# Altium schematic sheet 19 SMB1358.SchDoc
size 868 x 576 mm
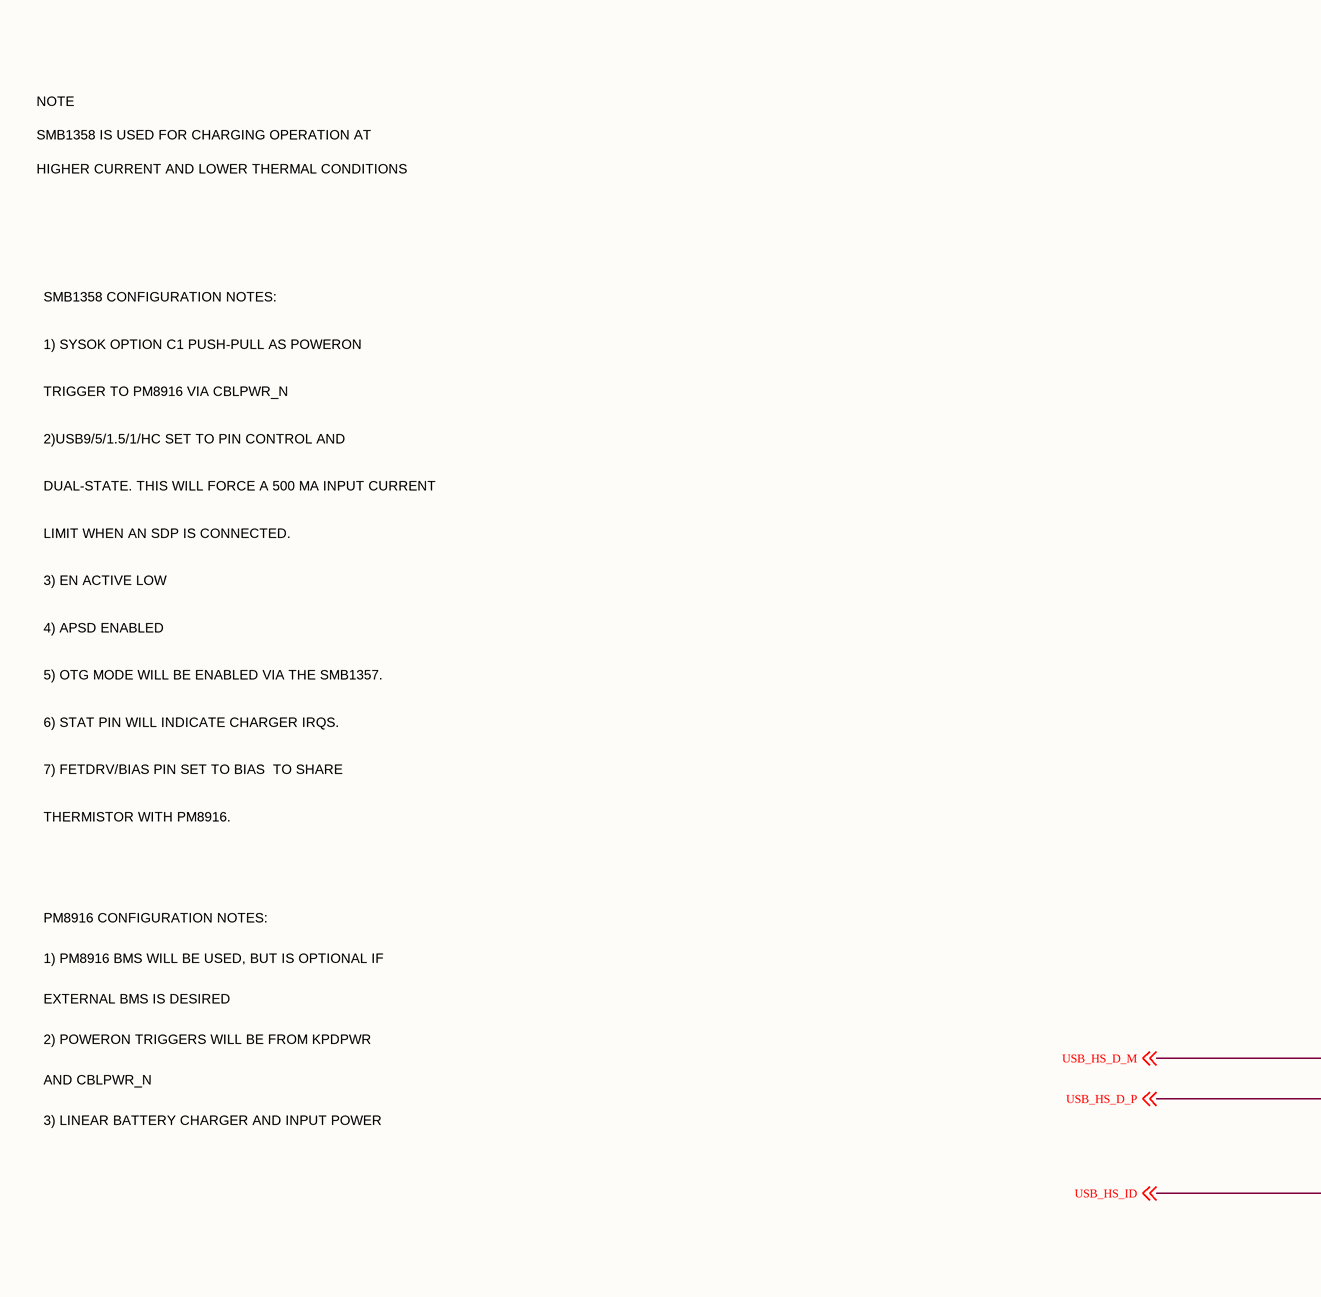
[diagram p0: 19 SMB1358.SchDoc, top left]
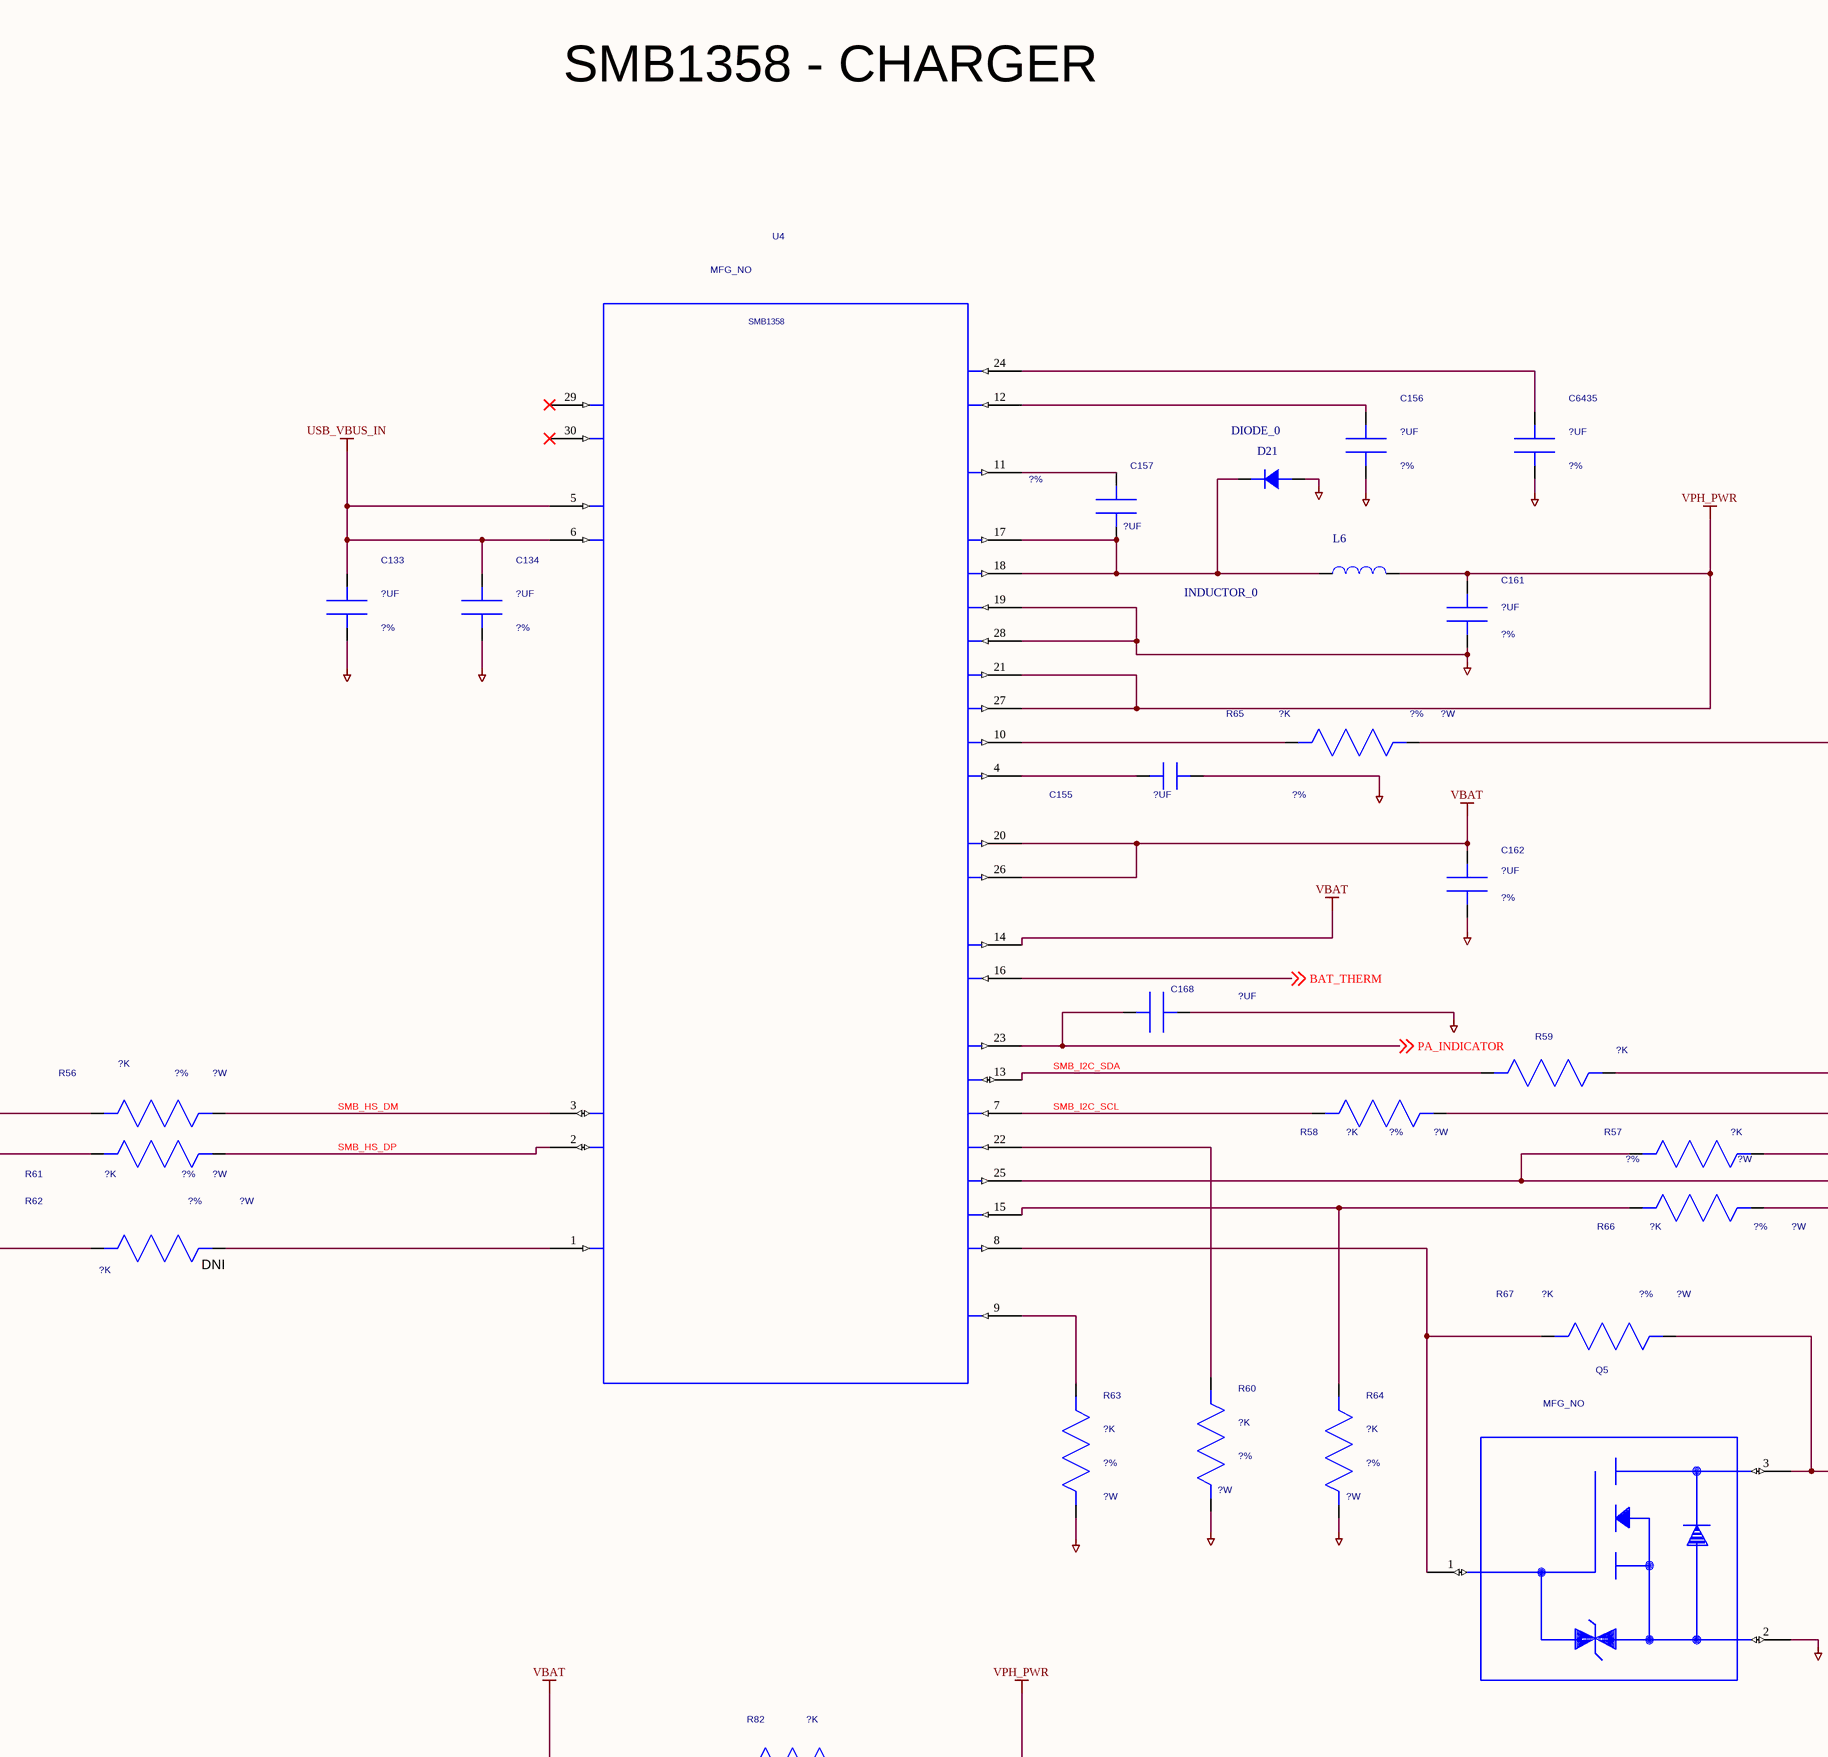
[diagram p1: 19 SMB1358.SchDoc, top middle]
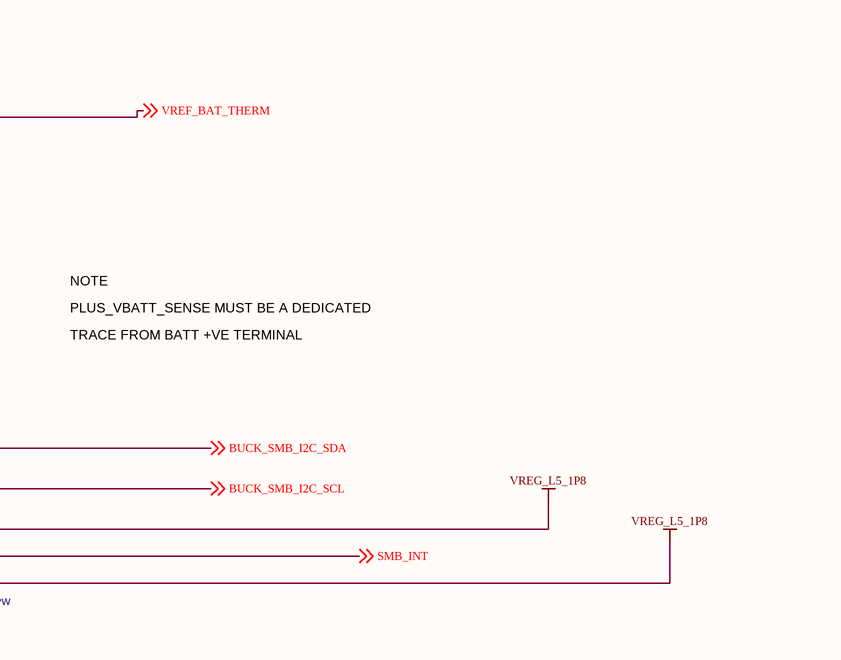
[diagram p2: 19 SMB1358.SchDoc, top right]
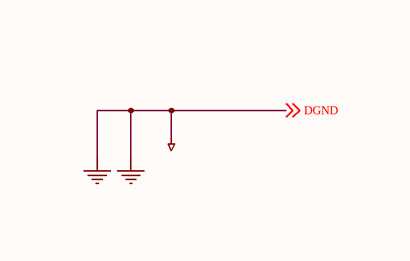
[diagram p3: 19 SMB1358.SchDoc, bottom left]
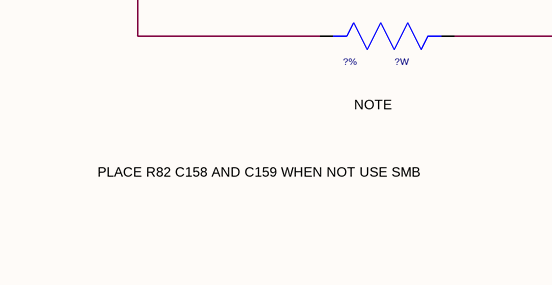
[diagram p4: 19 SMB1358.SchDoc, bottom middle]
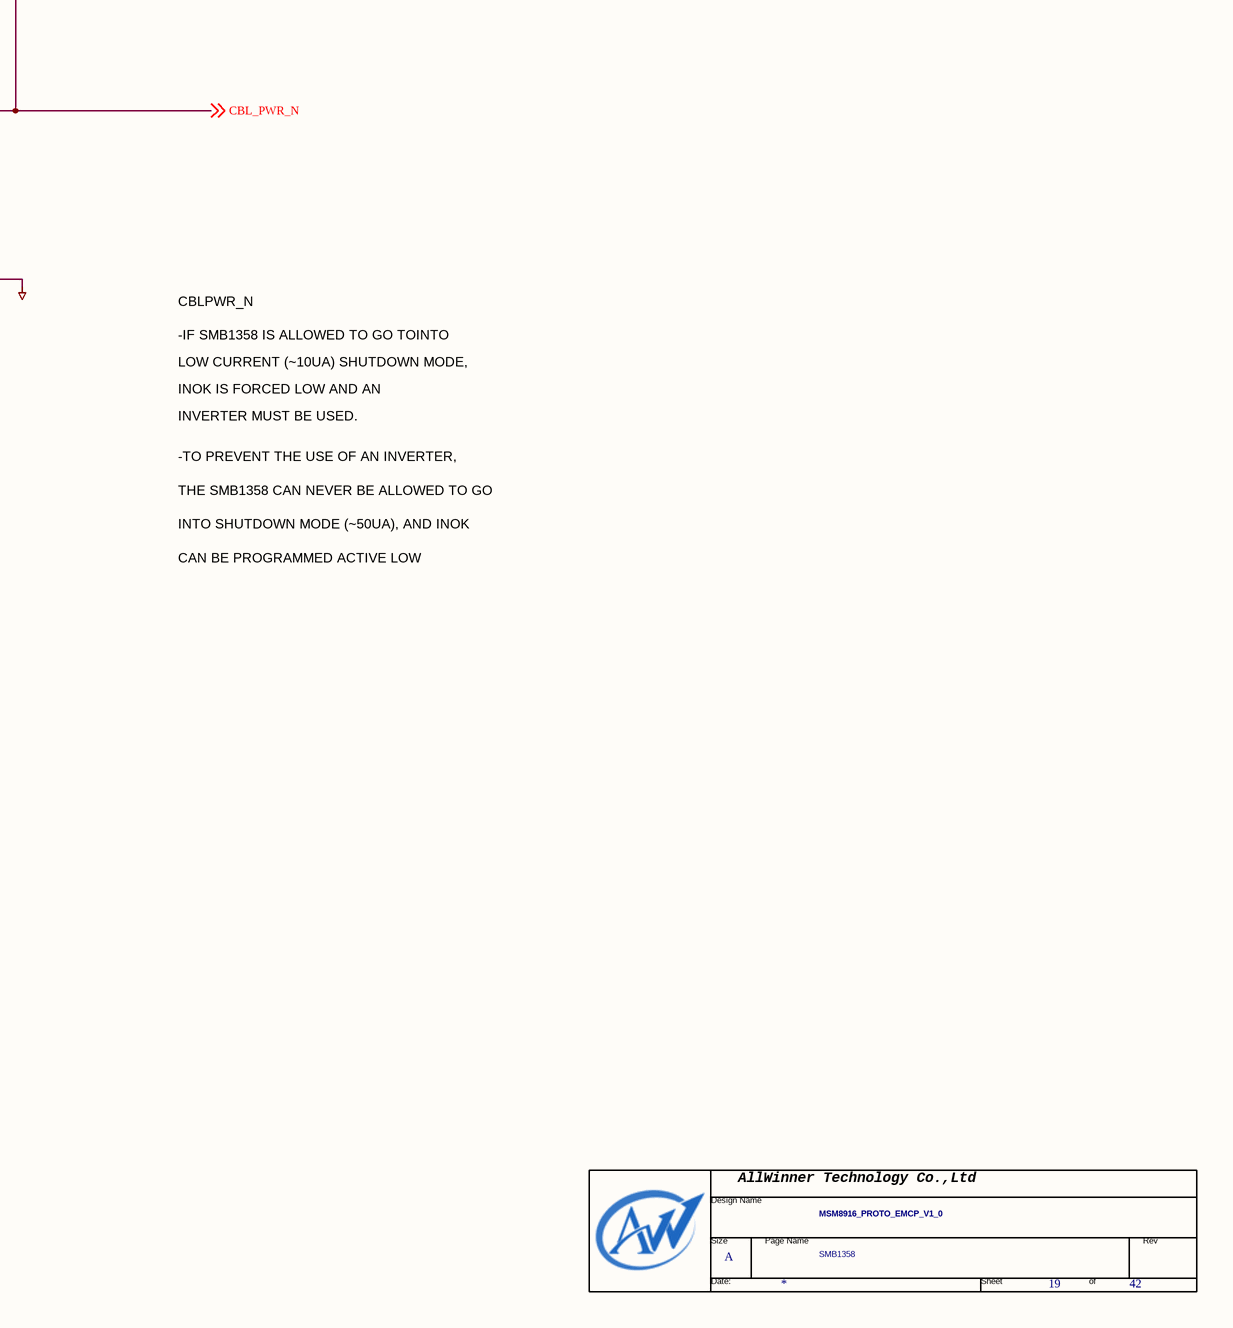
[diagram p5: 19 SMB1358.SchDoc, bottom right]

## Parts
*  Page Count: 42  Page Number: 19  Page Size: A  Title: MSM8916_PROTO_EMCP_V1_0  Doc: SMB1358  (hidden comment: TitleBlock0-AW)  (graphical)
C133  ?UF  Tolerance: ?%
C134  ?UF  Tolerance: ?%
C155  ?UF  Tolerance: ?%
C156  ?UF  Tolerance: ?%
C157  ?UF  Tolerance: ?%
C161  ?UF  Tolerance: ?%
C162  ?UF  Tolerance: ?%
C168  ?UF
C6435  ?UF  Tolerance: ?%
D21  DIODE_0
L6  INDUCTOR_0
Q5  PART_ID: MFG_NO  (hidden comment: nfet_zener_bidir)
R56  ?K  Tolerance: ?%  POWER: ?W
R57  ?K  Tolerance: ?%  POWER: ?W
R58  ?K  Tolerance: ?%  POWER: ?W
R59  ?K
R60  ?K  Tolerance: ?%  POWER: ?W
R61  ?K  Tolerance: ?%  POWER: ?W
R62  ?K  Tolerance: ?%  POWER: ?W
R63  ?K  Tolerance: ?%  POWER: ?W
R64  ?K  Tolerance: ?%  POWER: ?W
R65  ?K  Tolerance: ?%  POWER: ?W
R66  ?K  Tolerance: ?%  POWER: ?W
R67  ?K  Tolerance: ?%  POWER: ?W
R82  ?K  Tolerance: ?%  POWER: ?W
U4  PART_ID: MFG_NO  BLOCKID: SMB1358  (hidden comment: asic_smb1358)

## Nets
DGND: C133.2(NEG) C134.2(NEG) C155.1(POS) C156.2(NEG) C161.2(NEG) C162.2(NEG) C168.2(NEG) C6435.2(NEG) D21.2(K) Q5.2(S) R60.2(NEG) R63.2(NEG) R64.2(NEG) U4.19(GND) U4.28(PGND) ; off-sheet DGND  [also labelled GND]
USB_VBUS_IN: C133.1(POS) C134.1(POS) U4.5(USBIN1) U4.6(USBIN2)
VBAT: C162.1(POS) R82.1(POS) U4.14(VBATT) U4.20(CHGOUT1) U4.26(CHGOUT2)
VPH_PWR: C161.1(POS) L6.2 R82.2(NEG) U4.21(VSYS1) U4.27(VSYS2)
VREG_L5_1P8: R57.2(NEG) R66.2(NEG)
BAT_THERM: U4.16(THERM) ; off-sheet BAT_THERM
BUCK_SMB_I2C_SCL: R58.2(NEG) ; off-sheet BUCK_SMB_I2C_SCL
BUCK_SMB_I2C_SDA: R59.2(NEG) ; off-sheet BUCK_SMB_I2C_SDA
CBL_PWR_N: Q5.3(D) R67.2(NEG) ; off-sheet CBL_PWR_N
PA_INDICATOR: C168.1(POS) U4.23(VCHG) ; off-sheet PA_INDICATOR
SMB_HS_DM: R56.2(NEG) U4.3(DM)
SMB_HS_DP: R61.2(NEG) U4.2(DP)
SMB_I2C_SCL: R58.1(POS) U4.7(SCL)
SMB_I2C_SDA: R59.1(POS) U4.13(SDA)
SMB_INT: R57.1(POS) U4.25(STAT) ; off-sheet SMB_INT
USB_HS_D_M: R56.1(POS) ; off-sheet USB_HS_D_M
USB_HS_D_P: R61.1(POS) ; off-sheet USB_HS_D_P
USB_HS_ID: R62.1(POS) ; off-sheet USB_HS_ID
VREF_BAT_THERM: R65.2(NEG) ; off-sheet VREF_BAT_THERM
NetC155_2: C155.2(NEG) U4.4(SYSON)
NetC156_1: C156.1(POS) U4.12(MIDUSBIN)
NetC157_1: C157.1(POS) U4.11(BOOT)
NetC157_2: C157.2(NEG) D21.1(A) L6.1 U4.17(SW1) U4.18(SW2)
NetC6435_1: C6435.1(POS) U4.24(MIDDCIN)
NetQ5_1: Q5.1(G) R67.1(POS) U4.8(SYSOK)
NetR60_1: R60.1(POS) U4.22(EN)
NetR62_2: R62.2(NEG) U4.1(OTG)
NetR63_1: R63.1(POS) U4.9(USB5)
NetR64_1: R64.1(POS) R66.1(POS) U4.15(SUSP)
NetR65_1: R65.1(POS) U4.10(BIAS)

Not connected (* = marked no-connect by the designer): U4 29(DCIN1)* 30(DCIN2)*

## Notes on the sheet
- SMB1358 - CHARGER
- NOTE
- SMB1358 IS USED FOR CHARGING OPERATION AT
- HIGHER CURRENT AND LOWER THERMAL CONDITIONS
- SMB1358 CONFIGURATION NOTES:
- TRIGGER TO PM8916 VIA CBLPWR_N
- 1) SYSOK OPTION C1 PUSH-PULL AS POWERON
- 2)USB9/5/1.5/1/HC SET TO PIN CONTROL AND
- LIMIT WHEN AN SDP IS CONNECTED.
- DUAL-STATE. THIS WILL FORCE A 500 MA INPUT CURRENT
- 3) EN ACTIVE LOW
- 4) APSD ENABLED
- 5) OTG MODE WILL BE ENABLED VIA THE SMB1357.
- 6) STAT PIN WILL INDICATE CHARGER IRQS.
- 7) FETDRV/BIAS PIN SET TO BIAS  TO SHARE
- THERMISTOR WITH PM8916.
- PLUS_VBATT_SENSE MUST BE A DEDICATED
- PM8916 CONFIGURATION NOTES:
- TRACE FROM BATT +VE TERMINAL
- EXTERNAL BMS IS DESIRED
- 1) PM8916 BMS WILL BE USED, BUT IS OPTIONAL IF
- AND CBLPWR_N
- 2) POWERON TRIGGERS WILL BE FROM KPDPWR
- 3) LINEAR BATTERY CHARGER AND INPUT POWER
- (near R62) DNI
- CBLPWR_N
- -IF SMB1358 IS ALLOWED TO GO TOINTO
- LOW CURRENT (~10UA) SHUTDOWN MODE,
- INOK IS FORCED LOW AND AN
- INVERTER MUST BE USED.
- -TO PREVENT THE USE OF AN INVERTER,
- THE SMB1358 CAN NEVER BE ALLOWED TO GO
- PLACE R82 C158 AND C159 WHEN NOT USE SMB
- CAN BE PROGRAMMED ACTIVE LOW
- INTO SHUTDOWN MODE (~50UA), AND INOK
- (in symbol TitleBlock0-AW) AllWinner Technology Co.,Ltd; Design Name; Size; Page Name; Rev; Date:; Sheet; of

## Library data of the parts
C133 C134 C156 C157 C161 C162 C6435 = CAP: PART_NUMBER: MCN_NO; PART_ID: MFG_NO; OriginalSymbolOrigin: (-100,75); VOLT: ?V; CDS_LMAN_SYM_OUTLINE: -75,25,75,-25; SYMNAME: CAP; PACK_TYPE: ?
C155 = CAP#1: PART_NUMBER: MCN_NO; PART_ID: MFG_NO; OriginalSymbolOrigin: (-75,50); VOLT: ?V; SYMNAME: CAP; CDS_LMAN_SYM_OUTLINE: -25,50,25,-50; PACK_TYPE: ?
C168 = CAP: PART_NUMBER: MCN_NO; PART_ID: MFG_NO; OriginalSymbolOrigin: (-100,75); VOLT: ?V; Tolerance: ?%; CDS_LMAN_SYM_OUTLINE: -75,25,75,-25; SYMNAME: CAP; PACK_TYPE: ?
Q5 = NFET_ZENER_BIDIR: PART_NUMBER: MCN_NO; OriginalSymbolOrigin: (-525,450); CDS_LMAN_SYM_OUTLINE: -475,450,475,-450; SYMNAME: nfet_zener_bidir; PACK_TYPE: ?
R56-R58 R61 R62 R65-R67 R82 = RESISTOR_Dup3: PART_NUMBER: MCN_NO; PART_ID: MFG_NO; OriginalSymbolOrigin: (-200,50); CDS_LMAN_SYM_OUTLINE: -150,50,150,-50; SYMNAME: resistor; PACK_TYPE: ?
R59 = RESISTOR_Dup3: PART_NUMBER: MCN_NO; PART_ID: MFG_NO; OriginalSymbolOrigin: (-200,50); Tolerance: ?%; POWER: ?W; CDS_LMAN_SYM_OUTLINE: -150,50,150,-50; SYMNAME: resistor; PACK_TYPE: ?
R60 R63 R64 = RESISTOR#1: PART_NUMBER: MCN_NO; PART_ID: MFG_NO; OriginalSymbolOrigin: (-50,200); CDS_LMAN_SYM_OUTLINE: -50,150,50,-150; SYMNAME: resistor; PACK_TYPE: ?
U4 = ASIC_SMB1358: PART_NUMBER: MCN_NO; OriginalSymbolOrigin: (-725,2000); CDS_LMAN_SYM_OUTLINE: -675,2000,675,-2000; SYMNAME: asic_smb1358; PACK_TYPE: ?
* = TitleBlock0-AW: RevCode: ?; Page Create Date: March  8, 1995; Page Modify Date: *